# Altium schematic sheet FPGA Power.SchDoc
size A3; SheetNumber: 3; SheetTotal: 16
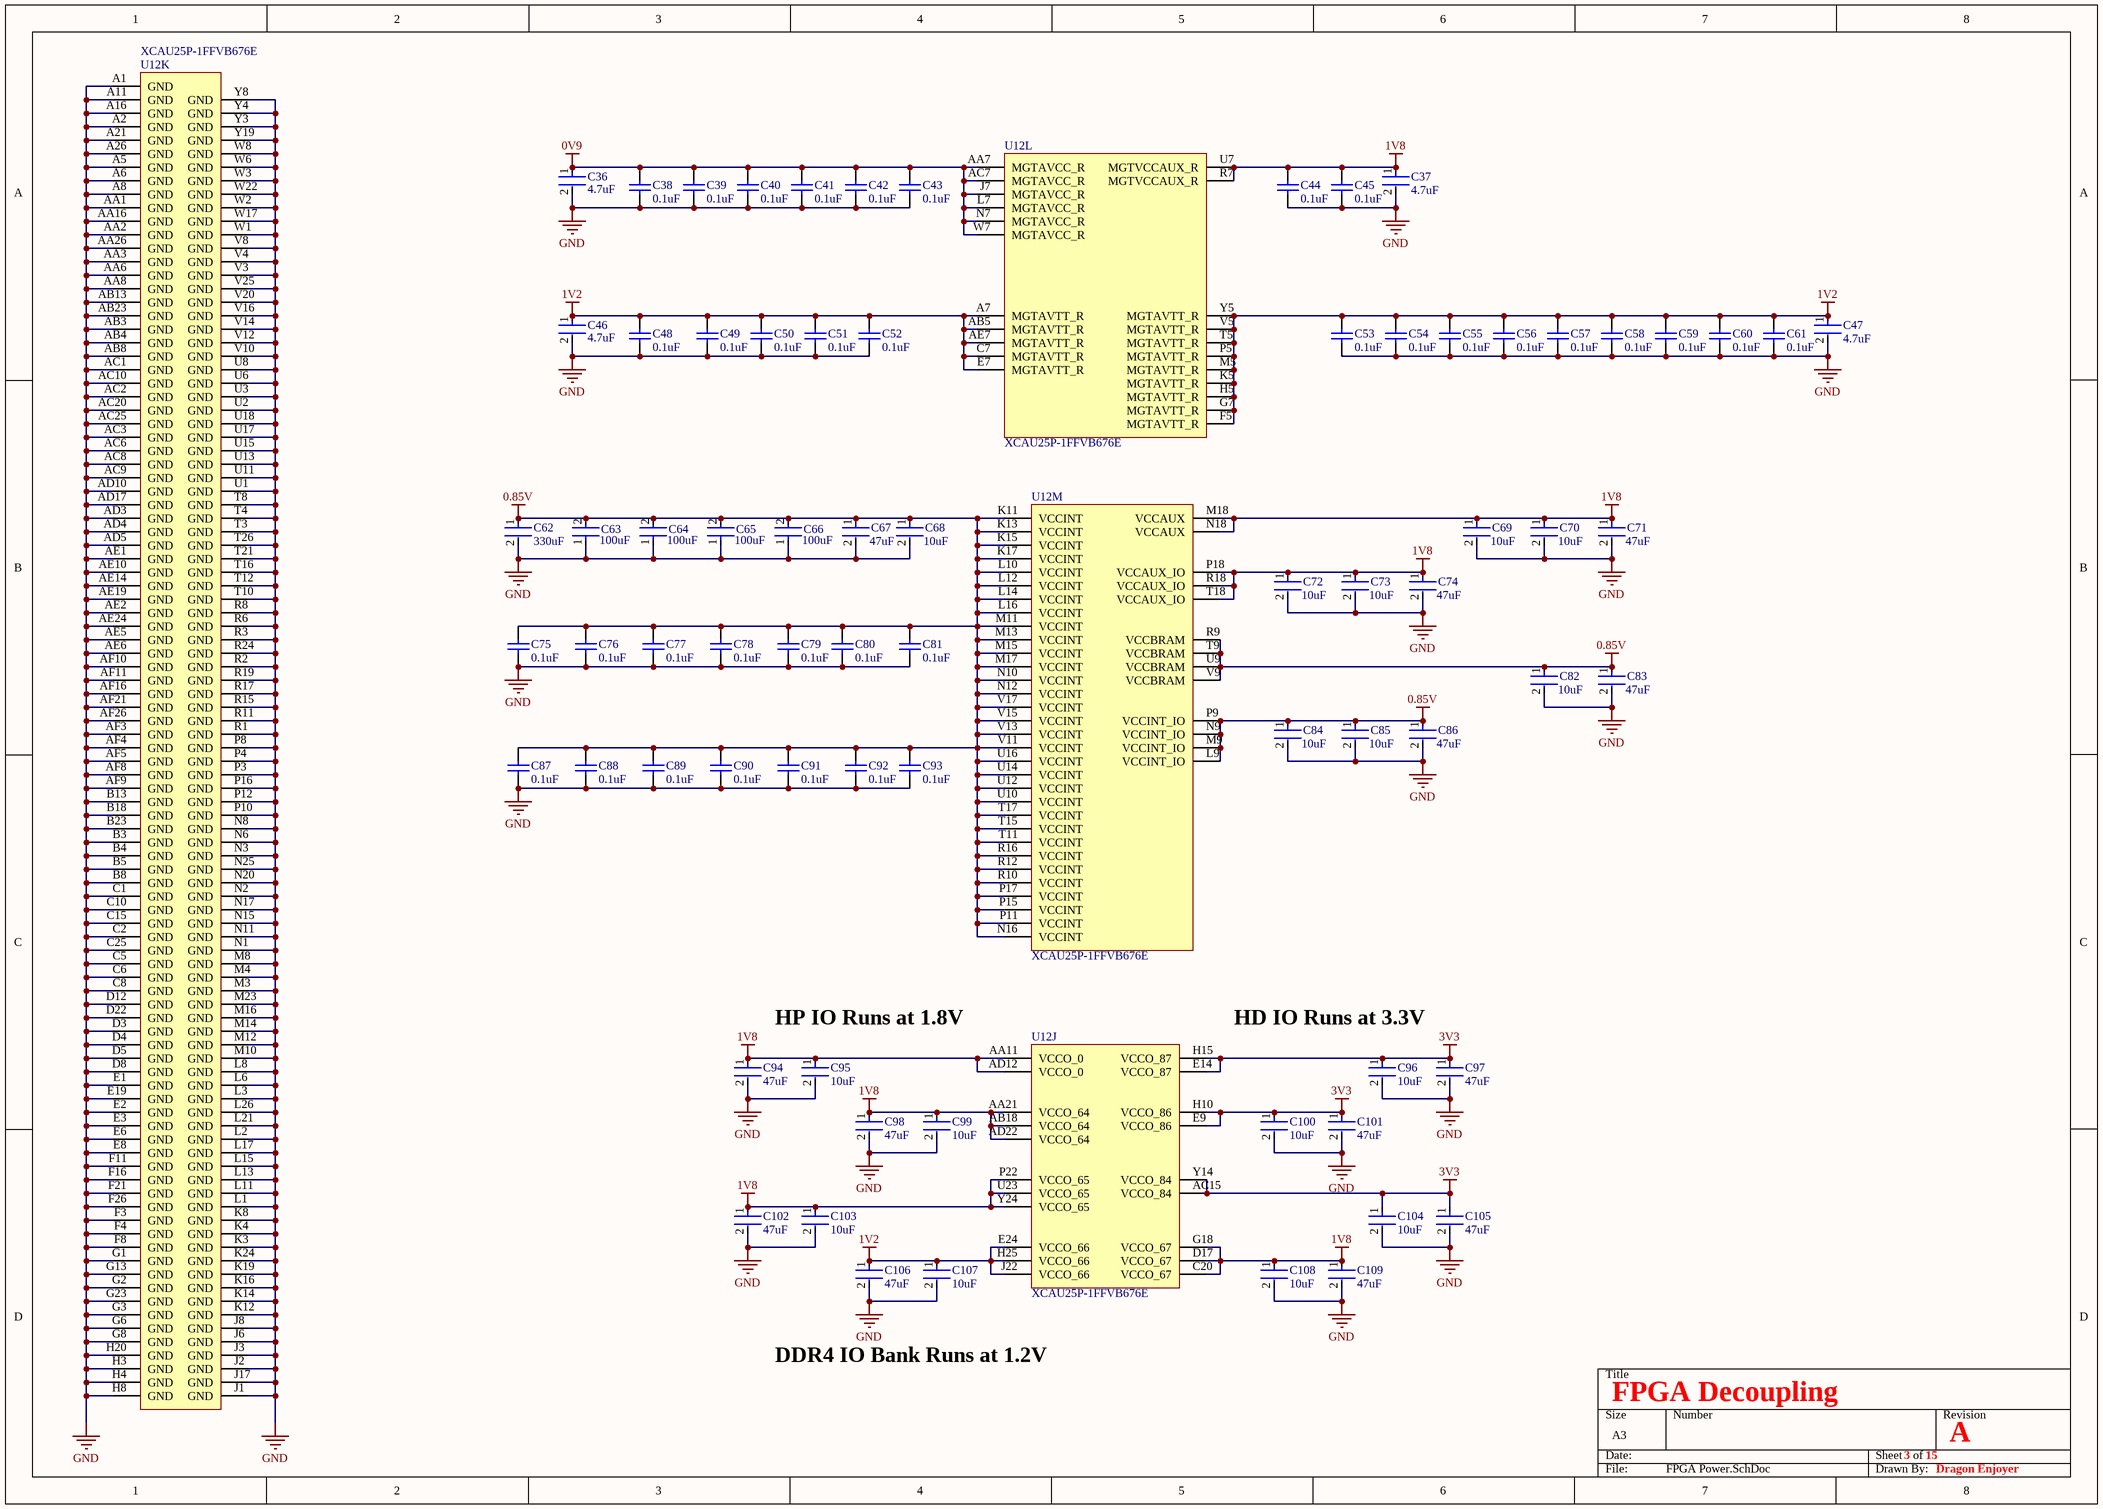
[diagram p0: FPGA Power.SchDoc]

## Parts
C36  Capacitance: 4.7uF  [FP-C1005-050-0_15-MFG]  (hidden comment: C1005X5R1A475K050BC)
C37  Capacitance: 4.7uF  [FP-C1005-050-0_15-MFG]  (hidden comment: C1005X5R1A475K050BC)
C38  value 0.1uF  [CAPC0603X33X15LL03T05]  (hidden comment: 02016D104KAT2A)
C39  value 0.1uF  [CAPC0603X33X15LL03T05]  (hidden comment: 02016D104KAT2A)
C40  value 0.1uF  [CAPC0603X33X15LL03T05]  (hidden comment: 02016D104KAT2A)
C41  value 0.1uF  [CAPC0603X33X15LL03T05]  (hidden comment: 02016D104KAT2A)
C42  value 0.1uF  [CAPC0603X33X15LL03T05]  (hidden comment: 02016D104KAT2A)
C43  value 0.1uF  [CAPC0603X33X15LL03T05]  (hidden comment: 02016D104KAT2A)
C44  value 0.1uF  [CAPC0603X33X15LL03T05]  (hidden comment: 02016D104KAT2A)
C45  value 0.1uF  [CAPC0603X33X15LL03T05]  (hidden comment: 02016D104KAT2A)
C46  Capacitance: 4.7uF  [FP-C1005-050-0_15-MFG]  (hidden comment: C1005X5R1A475K050BC)
C47  Capacitance: 4.7uF  [FP-C1005-050-0_15-MFG]  (hidden comment: C1005X5R1A475K050BC)
C48  value 0.1uF  [CAPC0603X33X15LL03T05]  (hidden comment: 02016D104KAT2A)
C49  value 0.1uF  [CAPC0603X33X15LL03T05]  (hidden comment: 02016D104KAT2A)
C50  value 0.1uF  [CAPC0603X33X15LL03T05]  (hidden comment: 02016D104KAT2A)
C51  value 0.1uF  [CAPC0603X33X15LL03T05]  (hidden comment: 02016D104KAT2A)
C52  value 0.1uF  [CAPC0603X33X15LL03T05]  (hidden comment: 02016D104KAT2A)
C53  value 0.1uF  [CAPC0603X33X15LL03T05]  (hidden comment: 02016D104KAT2A)
C54  value 0.1uF  [CAPC0603X33X15LL03T05]  (hidden comment: 02016D104KAT2A)
C55  value 0.1uF  [CAPC0603X33X15LL03T05]  (hidden comment: 02016D104KAT2A)
C56  value 0.1uF  [CAPC0603X33X15LL03T05]  (hidden comment: 02016D104KAT2A)
C57  value 0.1uF  [CAPC0603X33X15LL03T05]  (hidden comment: 02016D104KAT2A)
C58  value 0.1uF  [CAPC0603X33X15LL03T05]  (hidden comment: 02016D104KAT2A)
C59  value 0.1uF  [CAPC0603X33X15LL03T05]  (hidden comment: 02016D104KAT2A)
C60  value 0.1uF  [CAPC0603X33X15LL03T05]  (hidden comment: 02016D104KAT2A)
C61  value 0.1uF  [CAPC0603X33X15LL03T05]  (hidden comment: 02016D104KAT2A)
C62  Capacitance: 330uF  [FP-GRM32E-0_3-IPC_C]  (hidden comment: GRM32EC80E337ME05L)
C63  Capacitance: 100uF  [FP-GRM21B-0_2-e0_2_0_7-IPC_C]  (hidden comment: GRM21BC80G107ME15L)
C64  Capacitance: 100uF  [FP-GRM21B-0_2-e0_2_0_7-IPC_C]  (hidden comment: GRM21BC80G107ME15L)
C65  Capacitance: 100uF  [FP-GRM21B-0_2-e0_2_0_7-IPC_C]  (hidden comment: GRM21BC80G107ME15L)
C66  Capacitance: 100uF  [FP-GRM21B-0_2-e0_2_0_7-IPC_C]  (hidden comment: GRM21BC80G107ME15L)
C67  Capacitance: 47uF  [FP-GRM188-0_2-IPC_C]  (hidden comment: GRM188C80E476ME05D)
C68  Capacitance: 10uF  [FP-GRM15-0_2-MFG]  (hidden comment: GRM155C80J106ME11D)
C69  Capacitance: 10uF  [FP-GRM15-0_2-MFG]  (hidden comment: GRM155C80J106ME11D)
C70  Capacitance: 10uF  [FP-GRM15-0_2-MFG]  (hidden comment: GRM155C80J106ME11D)
C71  Capacitance: 47uF  [FP-GRM188-0_2-IPC_C]  (hidden comment: GRM188C80E476ME05D)
C72  Capacitance: 10uF  [FP-GRM15-0_2-MFG]  (hidden comment: GRM155C80J106ME11D)
C73  Capacitance: 10uF  [FP-GRM15-0_2-MFG]  (hidden comment: GRM155C80J106ME11D)
C74  Capacitance: 47uF  [FP-GRM188-0_2-IPC_C]  (hidden comment: GRM188C80E476ME05D)
C75  value 0.1uF  [CAPC0603X33X15LL03T05]  (hidden comment: 02016D104KAT2A)
C76  value 0.1uF  [CAPC0603X33X15LL03T05]  (hidden comment: 02016D104KAT2A)
C77  value 0.1uF  [CAPC0603X33X15LL03T05]  (hidden comment: 02016D104KAT2A)
C78  value 0.1uF  [CAPC0603X33X15LL03T05]  (hidden comment: 02016D104KAT2A)
C79  value 0.1uF  [CAPC0603X33X15LL03T05]  (hidden comment: 02016D104KAT2A)
C80  value 0.1uF  [CAPC0603X33X15LL03T05]  (hidden comment: 02016D104KAT2A)
C81  value 0.1uF  [CAPC0603X33X15LL03T05]  (hidden comment: 02016D104KAT2A)
C82  Capacitance: 10uF  [FP-GRM15-0_2-MFG]  (hidden comment: GRM155C80J106ME11D)
C83  Capacitance: 47uF  [FP-GRM188-0_2-IPC_C]  (hidden comment: GRM188C80E476ME05D)
C84  Capacitance: 10uF  [FP-GRM15-0_2-MFG]  (hidden comment: GRM155C80J106ME11D)
C85  Capacitance: 10uF  [FP-GRM15-0_2-MFG]  (hidden comment: GRM155C80J106ME11D)
C86  Capacitance: 47uF  [FP-GRM188-0_2-IPC_C]  (hidden comment: GRM188C80E476ME05D)
C87  value 0.1uF  [CAPC0603X33X15LL03T05]  (hidden comment: 02016D104KAT2A)
C88  value 0.1uF  [CAPC0603X33X15LL03T05]  (hidden comment: 02016D104KAT2A)
C89  value 0.1uF  [CAPC0603X33X15LL03T05]  (hidden comment: 02016D104KAT2A)
C90  value 0.1uF  [CAPC0603X33X15LL03T05]  (hidden comment: 02016D104KAT2A)
C91  value 0.1uF  [CAPC0603X33X15LL03T05]  (hidden comment: 02016D104KAT2A)
C92  value 0.1uF  [CAPC0603X33X15LL03T05]  (hidden comment: 02016D104KAT2A)
C93  value 0.1uF  [CAPC0603X33X15LL03T05]  (hidden comment: 02016D104KAT2A)
C94  Capacitance: 47uF  [FP-GRM188-0_2-IPC_C]  (hidden comment: GRM188C80E476ME05D)
C95  Capacitance: 10uF  [FP-GRM15-0_2-MFG]  (hidden comment: GRM155C80J106ME11D)
C96  Capacitance: 10uF  [FP-GRM15-0_2-MFG]  (hidden comment: GRM155C80J106ME11D)
C97  Capacitance: 47uF  [FP-GRM188-0_2-IPC_C]  (hidden comment: GRM188C80E476ME05D)
C98  Capacitance: 47uF  [FP-GRM188-0_2-IPC_C]  (hidden comment: GRM188C80E476ME05D)
C99  Capacitance: 10uF  [FP-GRM15-0_2-MFG]  (hidden comment: GRM155C80J106ME11D)
C100  Capacitance: 10uF  [FP-GRM15-0_2-MFG]  (hidden comment: GRM155C80J106ME11D)
C101  Capacitance: 47uF  [FP-GRM188-0_2-IPC_C]  (hidden comment: GRM188C80E476ME05D)
C102  Capacitance: 47uF  [FP-GRM188-0_2-IPC_C]  (hidden comment: GRM188C80E476ME05D)
C103  Capacitance: 10uF  [FP-GRM15-0_2-MFG]  (hidden comment: GRM155C80J106ME11D)
C104  Capacitance: 10uF  [FP-GRM15-0_2-MFG]  (hidden comment: GRM155C80J106ME11D)
C105  Capacitance: 47uF  [FP-GRM188-0_2-IPC_C]  (hidden comment: GRM188C80E476ME05D)
C106  Capacitance: 47uF  [FP-GRM188-0_2-IPC_C]  (hidden comment: GRM188C80E476ME05D)
C107  Capacitance: 10uF  [FP-GRM15-0_2-MFG]  (hidden comment: GRM155C80J106ME11D)
C108  Capacitance: 10uF  [FP-GRM15-0_2-MFG]  (hidden comment: GRM155C80J106ME11D)
C109  Capacitance: 47uF  [FP-GRM188-0_2-IPC_C]  (hidden comment: GRM188C80E476ME05D)
U12  XCAU25P-1FFVB676E  [BGA676C100P26X26_2600X2600X352]  (parts J,K,L,M of 14)

## Nets
0.85V: C62.1 C63.2 C64.2 C65.2 C66.2 C67.1 C68.1 C75.2 C76.2 C77.2 C78.2 C79.2 C80.2 C81.2 C82.1 C83.1 C84.1 C85.1 C86.1 C87.2 C88.2 C89.2 C90.2 C91.2 C92.2 C93.2 U12.K11(VCCINT) U12.K13(VCCINT) U12.K15(VCCINT) U12.K17(VCCINT) U12.L9(VCCINT_IO) U12.L10(VCCINT) U12.L12(VCCINT) U12.L14(VCCINT) U12.L16(VCCINT) U12.M9(VCCINT_IO) U12.M11(VCCINT) U12.M13(VCCINT) U12.M15(VCCINT) U12.M17(VCCINT) U12.N9(VCCINT_IO) U12.N10(VCCINT) U12.N12(VCCINT) U12.N16(VCCINT) U12.P9(VCCINT_IO) U12.P11(VCCINT) U12.P15(VCCINT) U12.P17(VCCINT) U12.R9(VCCBRAM) U12.R10(VCCINT) U12.R12(VCCINT) U12.R16(VCCINT) U12.T9(VCCBRAM) U12.T11(VCCINT) U12.T15(VCCINT) U12.T17(VCCINT) U12.U9(VCCBRAM) U12.U10(VCCINT) U12.U12(VCCINT) U12.U14(VCCINT) U12.U16(VCCINT) U12.V9(VCCBRAM) U12.V11(VCCINT) U12.V13(VCCINT) U12.V15(VCCINT) U12.V17(VCCINT)
0V9: C36.1 C38.2 C39.2 C40.2 C41.2 C42.2 C43.2 U12.AA7(MGTAVCC_R) U12.AC7(MGTAVCC_R) U12.J7(MGTAVCC_R) U12.L7(MGTAVCC_R) U12.N7(MGTAVCC_R) U12.W7(MGTAVCC_R)
1V2: C46.1 C47.1 C48.2 C49.2 C50.2 C51.2 C52.2 C53.2 C54.2 C55.2 C56.2 C57.2 C58.2 C59.2 C60.2 C61.2 C106.1 C107.1 U12.A7(MGTAVTT_R) U12.AB5(MGTAVTT_R) U12.AE7(MGTAVTT_R) U12.C7(MGTAVTT_R) U12.E7(MGTAVTT_R) U12.E24(VCCO_66) U12.F5(MGTAVTT_R) U12.G7(MGTAVTT_R) U12.H5(MGTAVTT_R) U12.H25(VCCO_66) U12.J22(VCCO_66) U12.K5(MGTAVTT_R) U12.M5(MGTAVTT_R) U12.P5(MGTAVTT_R) U12.T5(MGTAVTT_R) U12.V5(MGTAVTT_R) U12.Y5(MGTAVTT_R)
1V8: C37.1 C44.2 C45.2 C69.1 C70.1 C71.1 C72.1 C73.1 C74.1 C94.1 C95.1 C98.1 C99.1 C102.1 C103.1 C108.1 C109.1 U12.AA11(VCCO_0) U12.AA21(VCCO_64) U12.AB18(VCCO_64) U12.AD12(VCCO_0) U12.AD22(VCCO_64) U12.C20(VCCO_67) U12.D17(VCCO_67) U12.G18(VCCO_67) U12.M18(VCCAUX) U12.N18(VCCAUX) U12.P18(VCCAUX_IO) U12.P22(VCCO_65) U12.R7(MGTVCCAUX_R) U12.R18(VCCAUX_IO) U12.T18(VCCAUX_IO) U12.U7(MGTVCCAUX_R) U12.U23(VCCO_65) U12.Y24(VCCO_65)
3V3: C96.1 C97.1 C100.1 C101.1 C104.1 C105.1 U12.AC15(VCCO_84) U12.E9(VCCO_86) U12.E14(VCCO_87) U12.H10(VCCO_86) U12.H15(VCCO_87) U12.Y14(VCCO_84)
GND: C36.2 C37.2 C38.1 C39.1 C40.1 C41.1 C42.1 C43.1 C44.1 C45.1 C46.2 C47.2 C48.1 C49.1 C50.1 C51.1 C52.1 C53.1 C54.1 C55.1 C56.1 C57.1 C58.1 C59.1 C60.1 C61.1 C62.2 C63.1 C64.1 C65.1 C66.1 C67.2 C68.2 C69.2 C70.2 C71.2 C72.2 C73.2 C74.2 C75.1 C76.1 C77.1 C78.1 C79.1 C80.1 C81.1 C82.2 C83.2 C84.2 C85.2 C86.2 C87.1 C88.1 C89.1 C90.1 C91.1 C92.1 C93.1 C94.2 C95.2 C96.2 C97.2 C98.2 C99.2 C100.2 C101.2 C102.2 C103.2 C104.2 C105.2 C106.2 C107.2 C108.2 C109.2 U12.A1(GND) U12.A2(GND) U12.A5(GND) U12.A6(GND) U12.A8(GND) U12.A11(GND) U12.A16(GND) U12.A21(GND) U12.A26(GND) U12.AA1(GND) U12.AA2(GND) U12.AA3(GND) U12.AA6(GND) U12.AA8(GND) U12.AA16(GND) U12.AA26(GND) U12.AB3(GND) U12.AB4(GND) U12.AB8(GND) U12.AB13(GND) U12.AB23(GND) U12.AC1(GND) U12.AC2(GND) U12.AC3(GND) U12.AC6(GND) U12.AC8(GND) U12.AC9(GND) U12.AC10(GND) U12.AC20(GND) U12.AC25(GND) U12.AD3(GND) U12.AD4(GND) U12.AD5(GND) U12.AD10(GND) U12.AD17(GND) U12.AE1(GND) U12.AE2(GND) U12.AE5(GND) U12.AE6(GND) U12.AE10(GND) U12.AE14(GND) U12.AE19(GND) U12.AE24(GND) U12.AF3(GND) U12.AF4(GND) U12.AF5(GND) U12.AF8(GND) U12.AF9(GND) U12.AF10(GND) U12.AF11(GND) U12.AF16(GND) U12.AF21(GND) U12.AF26(GND) U12.B3(GND) U12.B4(GND) U12.B5(GND) U12.B8(GND) U12.B13(GND) U12.B18(GND) U12.B23(GND) U12.C1(GND) U12.C2(GND) U12.C5(GND) U12.C6(GND) U12.C8(GND) U12.C10(GND) U12.C15(GND) U12.C25(GND) U12.D3(GND) U12.D4(GND) U12.D5(GND) U12.D8(GND) U12.D12(GND) U12.D22(GND) U12.E1(GND) U12.E2(GND) U12.E3(GND) U12.E6(GND) U12.E8(GND) U12.E19(GND) U12.F3(GND) U12.F4(GND) U12.F8(GND) U12.F11(GND) U12.F16(GND) U12.F21(GND) U12.F26(GND) U12.G1(GND) U12.G2(GND) U12.G3(GND) U12.G6(GND) U12.G8(GND) U12.G13(GND) U12.G23(GND) U12.H3(GND) U12.H4(GND) U12.H8(GND) U12.H20(GND) U12.J1(GND) U12.J2(GND) U12.J3(GND) U12.J6(GND) U12.J8(GND) U12.J17(GND) U12.K3(GND) U12.K4(GND) U12.K8(GND) U12.K12(GND) U12.K14(GND) U12.K16(GND) U12.K19(GND) U12.K24(GND) U12.L1(GND) U12.L2(GND) U12.L3(GND) U12.L6(GND) U12.L8(GND) U12.L11(GND) U12.L13(GND) U12.L15(GND) U12.L17(GND) U12.L21(GND) U12.L26(GND) U12.M3(GND) U12.M4(GND) U12.M8(GND) U12.M10(GND) U12.M12(GND) U12.M14(GND) U12.M16(GND) U12.M23(GND) U12.N1(GND) U12.N2(GND) U12.N3(GND) U12.N6(GND) U12.N8(GND) U12.N11(GND) U12.N15(GND) U12.N17(GND) U12.N20(GND) U12.N25(GND) U12.P3(GND) U12.P4(GND) U12.P8(GND) U12.P10(GND) U12.P12(GND) U12.P16(GND) U12.R1(GND) U12.R2(GND) U12.R3(GND) U12.R6(GND) U12.R8(GND) U12.R11(GND) U12.R15(GND) U12.R17(GND) U12.R19(GND) U12.R24(GND) U12.T3(GND) U12.T4(GND) U12.T8(GND) U12.T10(GND) U12.T12(GND) U12.T16(GND) U12.T21(GND) U12.T26(GND) U12.U1(GND) U12.U2(GND) U12.U3(GND) U12.U6(GND) U12.U8(GND) U12.U11(GND) U12.U13(GND) U12.U15(GND) U12.U17(GND) U12.U18(GND) U12.V3(GND) U12.V4(GND) U12.V8(GND) U12.V10(GND) U12.V12(GND) U12.V14(GND) U12.V16(GND) U12.V20(GND) U12.V25(GND) U12.W1(GND) U12.W2(GND) U12.W3(GND) U12.W6(GND) U12.W8(GND) U12.W17(GND) U12.W22(GND) U12.Y3(GND) U12.Y4(GND) U12.Y8(GND) U12.Y19(GND)

## Notes on the sheet
- HP IO Runs at 1.8V
- HD IO Runs at 3.3V
- DDR4 IO Bank Runs at 1.2V
- FPGA Decoupling
- 3
- 15
- A
- Dragon Enjoyer

## Library data of the parts
C36 C37 C46 C47 = CMP-2000-05997-2: CAP CER 4.7UF 10V X5R 0402; Dielectric Material: Ceramic; Tolerance: 10%; Series: C; Package Quantity: 10000; Max Operating Temperature: 85°C; Case Code (Imperial): 0402; Lead Free: Lead Free; Voltage Rating (DC): 10V; Packaging: Cut Tape; Voltage Rating: 10V; Min Operating Temperature: -55°C; Dielectric: X5R; Thickness: 0.022inch; Width: 0.02inch; Case/Package: 0402; Case Code (Metric): 1005; Length: 0.039inch; RoHS Compliant: Yes; REACH SVHC: No SVHC; Mount: Surface Mount
C38-C45 C48-C61 C75-C81 C87-C93 = CMP-2010-00159-1: Manufacturer: AVX Interconnect / Elco; Part Number: 02016D104KAT2A
C62 = CMP-06035-049468-1: Chip Multilayer Ceramic Capacitors for General Purpose, 1210, 330uF, X6S, 22%, 20%, 2.5V; Tolerance: 20%; Packaging: Tape and Reel; Mount: Surface Mount; Max Operating Temperature: 105°C; Min Operating Temperature: -55°C; Case Code (Imperial): 1210; Length: 0.126inch; Voltage Rating (DC): 2.5V; Dielectric: X6S; Thickness: 0.11inch; Case Code (Metric): 3225; Width: 0.098inch; Voltage Rating: 2.5V; Case/Package: 1210
C63-C66 = CMP-06035-010229-1: Chip Multilayer Ceramic Capacitors for General Purpose, 0805, 100uF, X6S, 22%, 20%, 4V; Case/Package: 0805; Packaging: Cut Tape; REACH SVHC: No SVHC; Min Operating Temperature: -55°C; Length: 0.079inch; Max Operating Temperature: 105°C; Case Code (Imperial): 0805; Width: 0.049inch; Case Code (Metric): 2012; Tolerance: 20%; Voltage Rating: 4V; Mount: Surface Mount; Voltage Rating (DC): 4V; Thickness: 0.057inch; Dielectric: X6S
C67 C71 C74 C83 C86 C94 C97 C98 C101 C102 C105 C106 C109 = CMP-06035-059951-1: Chip Multilayer Ceramic Capacitors for General Purpose, 0603, 47uF, X6S, 22%, 20%, 2.5V; Min Operating Temperature: -55°C; Length: 0.063inch; Thickness: 0.039inch; Tolerance: 20%; Width: 0.031inch; Case Code (Metric): 1608; Voltage Rating: 2.5V; Voltage Rating (DC): 2.5V; Case Code (Imperial): 0603; Dielectric: X6S; Mount: Surface Mount; Case/Package: 0603; Max Operating Temperature: 105°C; Packaging: Tape and Reel
C68-C70 C72 C73 C82 C84 C85 C95 C96 C99 C100 C103 C104 C107 C108 = CMP-06035-000074-1: CAP CER 10UF 6.3V X6S 0402; Manufacturer: Murata; Tolerance: 20%; Material: Ceramic; Temperature Coefficient: 22%; ComponentLink2Description: Datasheet; Temperature Characteristic: X6S; RoHS: TRUE; Value: 10uF; Temperature: -55°C to +105°C; Device Class L2: Capacitors; Height: 0.7mm; Category: Cap; Manufacturer Part Number: GRM155C80J106ME11D; Device Class L1: Passive Components; Temperature Range Low: -55°C; Automotive: No; Mouser Description: Cap Ceramic 10uF 6.3V X6S 20% Pad SMD 0402 105C T/R; ComponentLink2URL: https://search.murata.co.jp/Ceramy/image/img/A01X/G101/ENG/GRM155C80J106ME11-01.pdf; Voltage Rating: 6.3V; Ipc Land Pattern Name: CAPC10050X50; Lead Free: Yes; Octopart: https://octopart.com/grm155c80j106me11d-murata-71220993; Digikey Description: CAP CER 10UF 6.3V X6S 0402; Temperature Range High: +105°C; Package: GRM15-0.2; Device Class L3: Ceramic Capacitors
U12 = CMP-020-00023-3: FPGA XCAU25 Family 308437 Logic Units 308437 Cells 0.85V 676-Pin FCBGA